# EAGLE design usb_snes (EAGLE 6.6.0)
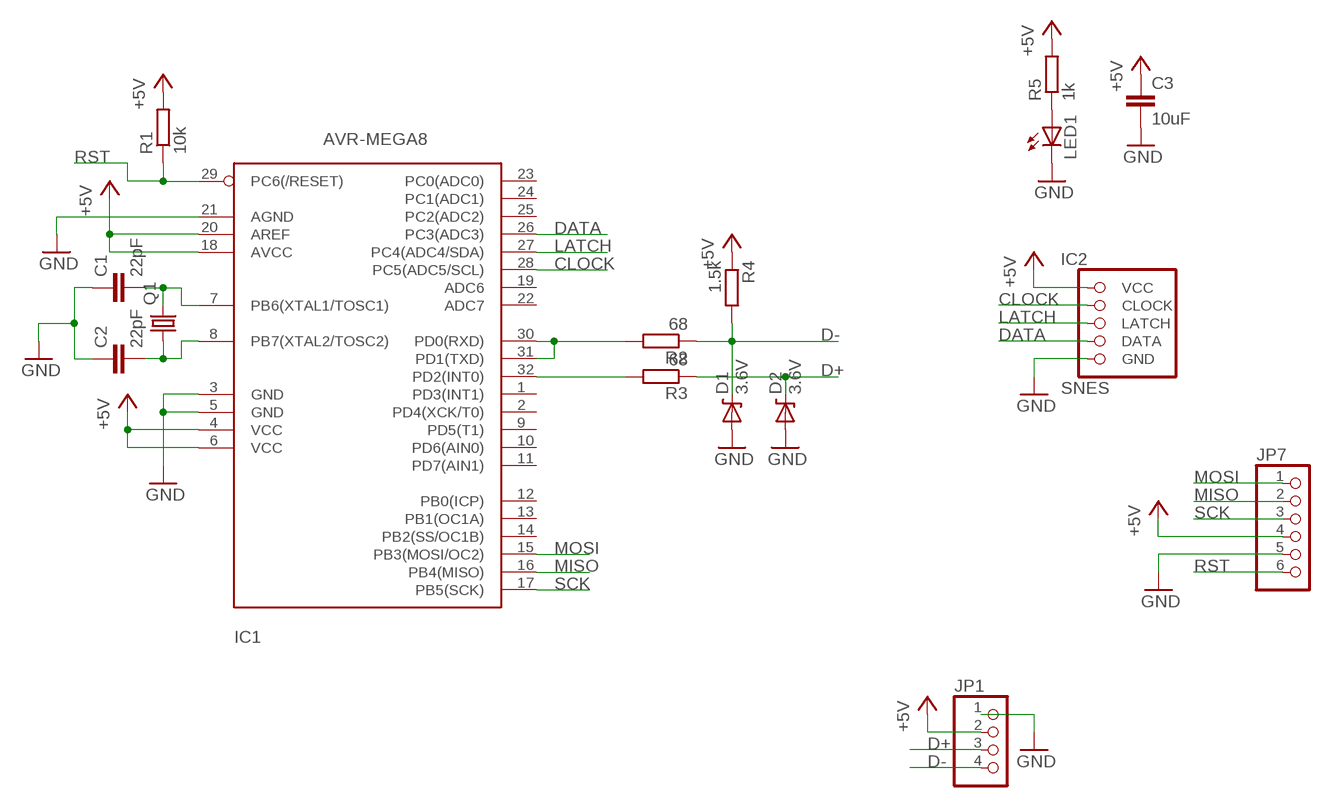
[diagram p0: schematic, sheet 1]

## Parts
C1  22pF  C-EUR0805  [R0805]
C2  22pF  C-EUR0805  [R0805]
C3  10uF  C-EUR0805  [R0805]
D1  3.6V  DIODE-ZENERFL  [SOD123FL]
D2  3.6V  DIODE-ZENERFL  [SOD123FL]
IC1  AVR-MEGA8  AVR-MEGA8-AI  [TQFP32-08]
IC2  SNES  [SNES]
JP1  PINHD-1X4S  [1X04-2MM]
JP7  PINHD-1X6S  [1X06-2MM]
LED1  LED0805  [CHIP-LED0805]
Q1  CRYSTALHC49UP  [HC49UP]
R1  10k  R-EU_R0805  [R0805]
R2  68  R-EU_R0805  [R0805]
R3  68  R-EU_R0805  [R0805]
R4  1.5k  R-EU_R0805  [R0805]
R5  1k  R-EU_R0805  [R0805]

## Nets
+5V: C3.1 IC1.4(VCC) IC1.6(VCC) IC1.18(AVCC) IC1.20(AREF) IC2.5(VCC) JP1.2 JP7.4 R1.2 R4.1 R5.2
CLOCK: IC1.28(PC5(ADC5/SCL)) IC2.4(CLOCK)
D+: D2.C JP1.3 R3.1
D-: D1.C JP1.4 R2.1 R4.2
DATA: IC1.26(PC3(ADC3)) IC2.2(DATA)
GND: C1.1 C2.1 C3.2 D1.A D2.A IC1.3(GND) IC1.5(GND) IC1.21(AGND) IC2.1(GND) JP1.1 JP7.5 LED1.C
LATCH: IC1.27(PC4(ADC4/SDA)) IC2.3(LATCH)
MISO: IC1.16(PB4(MISO)) JP7.2
MOSI: IC1.15(PB3(MOSI/OC2)) JP7.1
N$2: C2.2 IC1.8(PB7(XTAL2/TOSC2)) Q1.1
N$3: C1.2 IC1.7(PB6(XTAL1/TOSC1)) Q1.2
N$4: IC1.30(PD0(RXD)) IC1.31(PD1(TXD)) R2.2
N$8: IC1.32(PD2(INT0)) R3.2
N$12: LED1.A R5.1
RST: IC1.29(PC6(/RESET)) JP7.6 R1.1
SCK: IC1.17(PB5(SCK)) JP7.3
Unconnected: IC1.1(PD3(INT1)) IC1.2(PD4(XCK/T0)) IC1.9(PD5(T1)) IC1.10(PD6(AIN0)) IC1.11(PD7(AIN1)) IC1.12(PB0(ICP)) IC1.13(PB1(OC1A)) IC1.14(PB2(SS/OC1B)) IC1.19(ADC6) IC1.22(ADC7) IC1.23(PC0(ADC0)) IC1.24(PC1(ADC1)) IC1.25(PC2(ADC2))

## Library data of the parts
C1-C3 = usb_snes:C-EU: CAPACITOR, European symbol
D1 D2 = usb_snes:DIODE-ZENER
IC1 = snes_usb:AVR-MEGA8: MICROCONTROLLER 8 Kbytes FLASH 1 kbytes SRAM 512 bytes EEPROM USART 6-channel 10 bit ADC 2-channel 8 bit ADC
IC2 = usb_snes:SNES
JP1 = usb_snes:PINHD-1X4: PIN HEADER
JP7 = usb_snes:PINHD-1X6: PIN HEADER
LED1 = usb_snes:LED
Q1 = usb_snes:CRYSTAL: CRYSTAL
R1-R5 = usb_snes:R-EU_: RESISTOR, European symbol

## Board
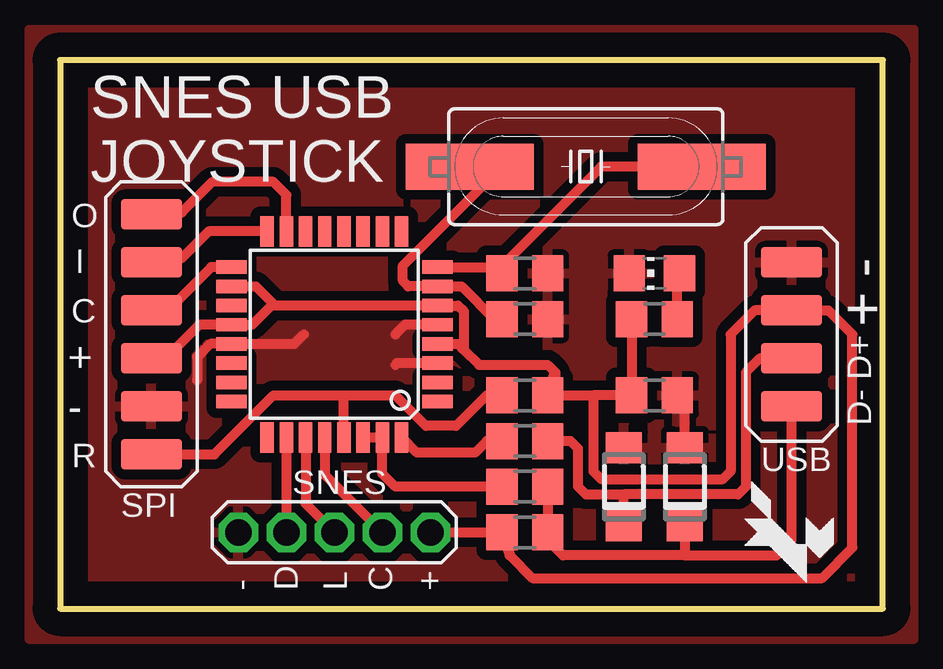
[diagram p1: board, top side]

Size 34.29 x 22.86 mm. Coordinates in mm from the lower left corner, seen from the top.
Outline: 34.29,22.86 0,22.86 0,0 34.29,0 34.29,22.86
Copper layers (1*16): Top 0.035mm / dielectric 1.5mm / Bottom 0.035mm
Design rules "default": minimum track width 10mil, minimum drill 24mil, track to track 8mil, track to pad 8mil, pad to pad 8mil, via to via 8mil, smd to smd 8mil, copper to edge 40mil, drill to drill 8mil, minimum pad ring 10mil, minimum via ring 8mil, stop-mask expansion 4mil, vias tented up to drill 0mil, thermal gap 10mil

### Footprints (pad centres in the part's own frame; a part is rotated, then mirrored left to right if it is on the bottom)
R0805 = smd 1.3 x 1.5: 1 -0.95,0; 2 0.95,0
SOD123FL = smd 1.3 x 1.5: A 1.625,0; C -1.625,0
TQFP32-08 = smd 1.27 x 0.559: 1 -4.293,2.8; 2 -4.293,2; 3 -4.293,1.2; 4 -4.293,0.4; 5 -4.293,-0.4; 6 -4.293,-1.2; 7 -4.293,-2; 8 -4.293,-2.8; 17 4.293,-2.8; 18 4.293,-2; 19 4.293,-1.2; 20 4.293,-0.4; 21 4.293,0.4; 22 4.293,1.2; 23 4.293,2; 24 4.293,2.8 | smd 0.559 x 1.27: 9 -2.8,-4.293; 10 -2,-4.293; 11 -1.2,-4.293; 12 -0.4,-4.293; 13 0.4,-4.293; 14 1.2,-4.293; 15 2,-4.293; 16 2.8,-4.293; 25 2.8,4.293; 26 2,4.293; 27 1.2,4.293; 28 0.4,4.293; 29 -0.4,4.293; 30 -1.2,4.293; 31 -2,4.293; 32 -2.8,4.293
SNES = drill 1.1 octagon: 1 -4,0; 2 -2,0; 3 0,0; 4 2,0; 5 4,0
1X04-2MM = smd 1.27 x 2.54: 1 -3,0; 2 -1,0; 3 1,0; 4 3,0
1X06-2MM = smd 1.27 x 2.54: 1 -5,0; 2 -3,0; 3 -1,0; 4 1,0; 5 3,0; 6 5,0
CHIP-LED0805 = smd 1.5 x 1.3: A 0,-1.05; C 0,1.05
HC49UP = smd 5.334 x 1.93: 1 -4.826,0; 2 4.826,0

### Placement (x,y rotation side)
C1  19.37,12.06 180 top
C2  19.37,13.97 180 top
C3  24.77,8.89 0 top
D1  26.04,5.08 90 top
D2  23.5,5.08 90 top
IC1  11.43,11.43 180 top
IC2  11.43,3.17 0 top
JP1  30.48,11.43 270 top
JP7  3.81,11.43 270 top
LED1  24.77,13.97 90 top
Q1  21.91,18.41 180 top
R1  19.37,8.89 0 top
R2  19.37,5.08 180 top
R3  19.37,6.99 180 top
R4  19.37,3.17 0 top
R5  24.77,12.06 180 top
U$1  [FOX-1]  30.48,3.17 0 top

### Tracks (layer width: path | path; a pad name or v marks a point on that pad's centre or on a via)
+5V
  Top 0.406: IC1.18 8.16,13.43 8.89,12.7 | 8.89,12.7 8.96,12.63 IC1.6 16.58,12.63 16.83,12.38 16.83,10.79 | 8.89,12.7 8.02,11.83 IC1.20 5.8,11.83 4.76,10.79 4.17,10.79 JP7.4 | IC2.5 R4.1 18.73,2.22 19.68,1.27 31.75,1.27 33.02,2.54 33.02,11.43 32.02,12.43 JP1.2 28.94,12.43 27.94,11.43 27.94,5.71 27.62,5.4 22.54,5.4 22.23,5.71 22.23,8.89 | R5.2 C3.1 22.23,8.89 | 20.64,8.89 R1.2 20.64,9.85 | 20.64,9.85 20.32,10.16 17.46,10.16 16.83,10.79 | IC1.4 16.59,11.03 16.83,10.79 | 20.64,9.85 20.64,9.84 20.64,8.89 | 20.64,8.89 22.23,8.89
CLOCK
  Top 0.406: IC1.28 11.03,5.58 IC2.4
D+
  Top 0.406: 23.5,4.76 28.26,4.76 28.57,5.08 28.57,9.84 29.16,10.43 JP1.3 | D2.C 23.5,4.76 | 20.95,6.99 R3.1 21.27,6.99 21.59,6.67 21.59,5.08 21.91,4.76 23.5,4.76
D-
  Top 0.406: R2.1 R4.2 20.64,2.54 20.95,2.22 26.04,2.22 | 26.04,3.17 D1.C 26.32,3.81 26.32,3.46 26.04,3.17 | 26.04,3.17 26.04,2.22 | 26.04,2.22 29.84,2.22 30.48,2.86 JP1.4
DATA
  Top 0.406: IC1.26 IC2.2
GND
  Top 0.406: 5.71,9.53 5.71,10.48 6.27,11.03 IC1.21 9.76,11.03 10.16,11.43 | D2.A 23.5,6.35 | 26.04,6.35 D1.A 26.04,8.57 C3.2 | IC1.3 14.04,10.23 13.97,10.16 | IC1.5 14.37,11.83 13.97,11.43
  pour Top (isolate 0.406): -1.27,-1.27 -1.27,24.13 35.56,24.13 35.56,-1.27
LATCH
  Top 0.406: IC1.27 10.23,4.38 IC2.3
MISO
  Top 0.406: IC1.16 6.2,15.72 5.08,14.61 3.98,14.61 JP7.2
MOSI
  Top 0.406: IC1.15 9.43,17.24 8.89,17.78 6.35,17.78 5.08,16.51 3.89,16.51 JP7.1
N$2
  Top 0.406: IC1.8 18.48,14.23 C2.2 18.42,14.29 22.54,18.41 Q1.1
N$3
  Top 0.406: Q1.2 18.03,18.03 14.29,14.29 14.29,13.65 14.51,13.43 IC1.7 16.73,13.43 18.1,12.06 C1.2
N$4
  Top 0.406: R2.2 13.97,5.08 13.43,5.62 IC1.31 IC1.30
N$8
  Top 0.406: IC1.32 14.87,6.5 17.3,6.5 17.78,6.99 R3.2
N$12
  Top 0.406: R5.1 25.71,13.87 LED1.A
RST
  Top 0.406: 11.83,8.89 8.89,8.89 6.43,6.43 JP7.6 | 11.83,8.89 13.97,8.89 15.24,7.62 16.51,7.62 17.78,8.89 R1.1 | IC1.29 11.83,8.89
SCK
  Top 0.406: IC1.17 6.29,14.23 4.13,12.06 4.17,12.06 JP7.3

### Text on the board
tNames: SNES USB / JOYSTICK | O | I | - | C | + | + | D+ | - | D- | R | USB | SNES | SPI | - | D | L | C | +